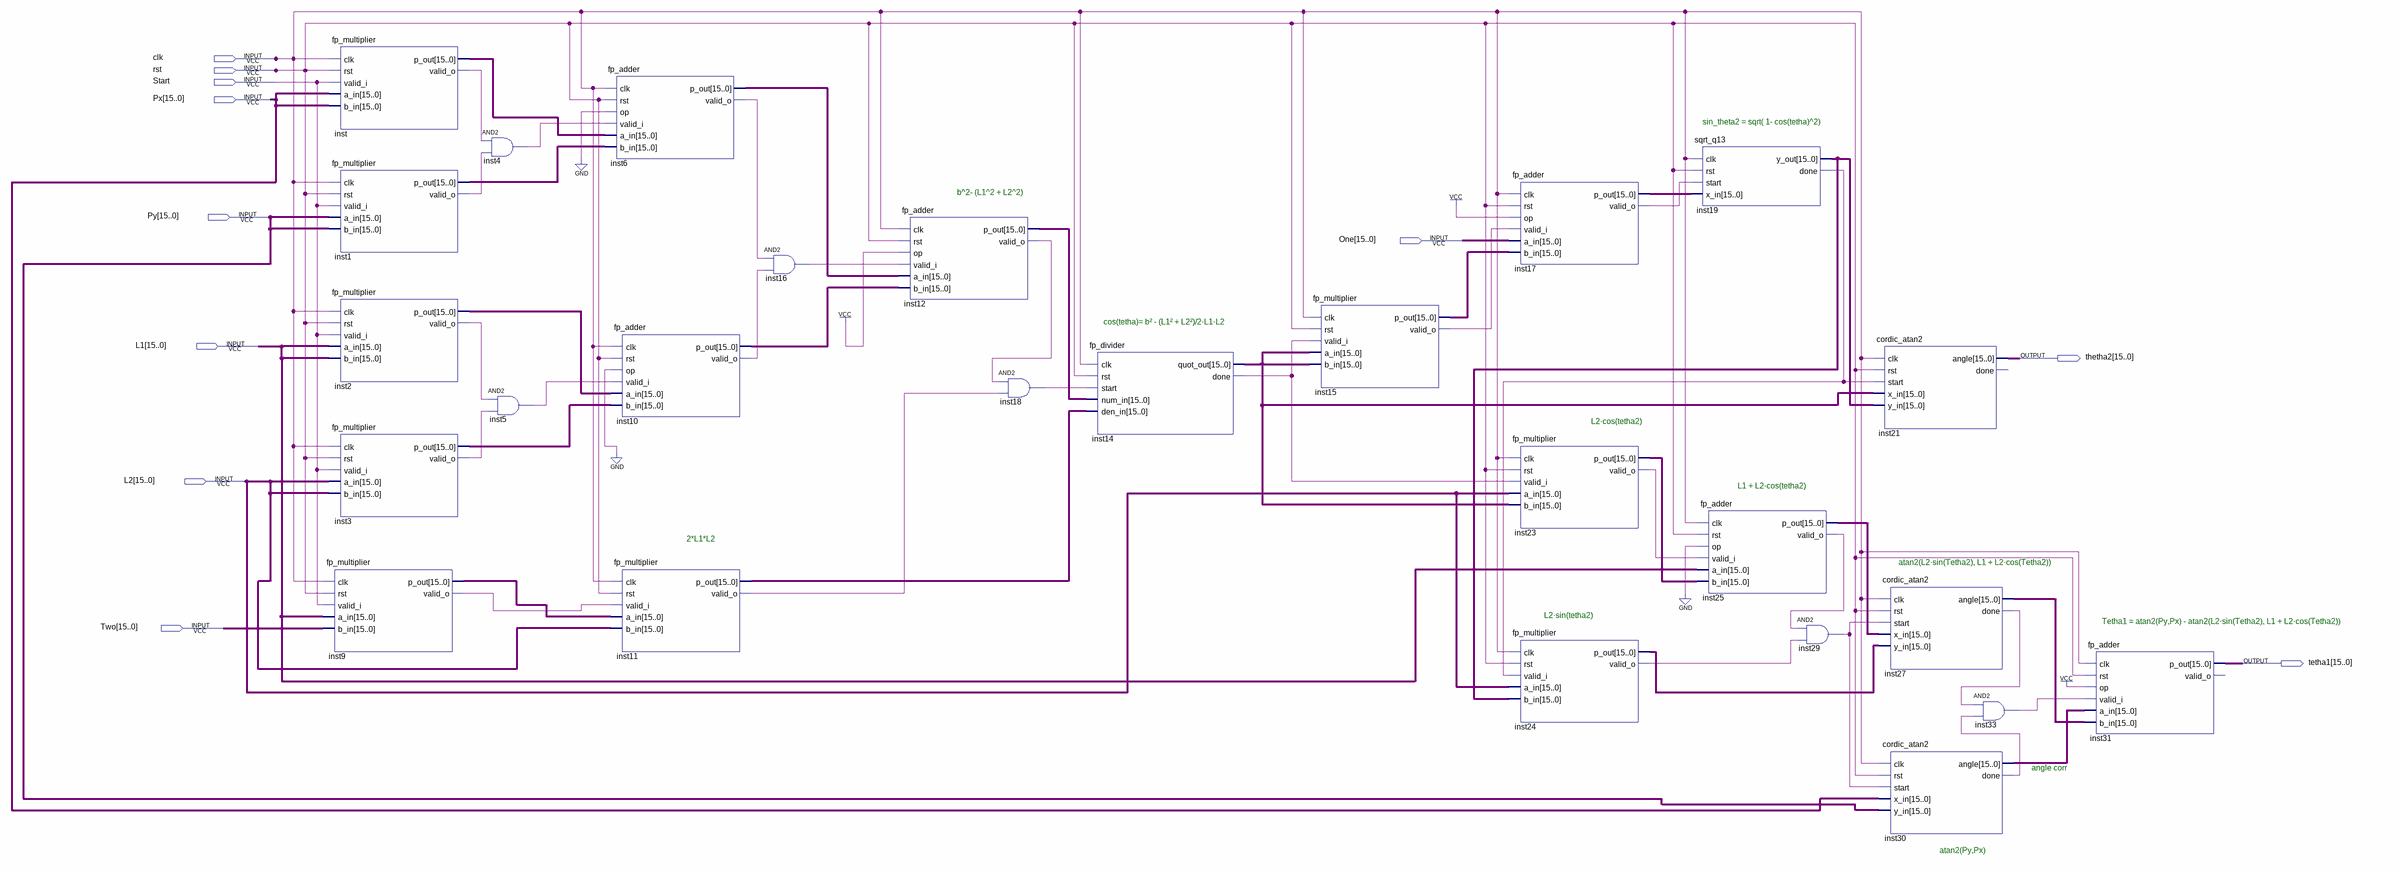
[diagram p0: schematic sheet]
// Quartus schematic Block2RTest.bdf as structural Verilog: 26 symbols, 11 pins
module Block2RTest (
  input  clk,
  input  rst,
  input  Start,
  input  [15:0] Px,
  input  [15:0] Py,
  input  [15:0] One,
  input  [15:0] L1,
  input  [15:0] L2,
  input  [15:0] Two,
  output [15:0] thetha2,
  output [15:0] tetha1
);

  wire inst1_valid_o, inst2_valid_o, inst3_valid_o, inst4_out, inst5_out, inst6_valid_o, inst9_valid_o,
       inst10_valid_o, inst11_valid_o, inst12_valid_o, inst14_done, inst15_valid_o, inst16_out,
       inst17_valid_o, inst18_out, inst19_done, inst23_valid_o, inst24_valid_o, inst25_valid_o, inst27_done,
       inst29_out, inst30_done, inst33_out, inst_valid_o;
  wire [15:0] inst1_p_out, inst2_p_out, inst3_p_out, inst6_p_out, inst9_p_out, inst10_p_out, inst11_p_out,
       inst12_p_out, inst14_quot_out, inst15_p_out, inst17_p_out, inst19_y_out, inst23_p_out, inst24_p_out,
       inst25_p_out, inst27_angle, inst30_angle, inst_p_out;

  fp_multiplier inst (
    .clk(clk), .rst(rst), .valid_i(Start), .a_in(Px), .b_in(Px), .p_out(inst_p_out), .valid_o(inst_valid_o));
  fp_multiplier inst1 (
    .clk(clk), .rst(rst), .valid_i(Start), .a_in(Py), .b_in(Py), .p_out(inst1_p_out), .valid_o(inst1_valid_o));
  fp_multiplier inst2 (
    .clk(clk), .rst(rst), .valid_i(Start), .a_in(L1), .b_in(L1), .p_out(inst2_p_out), .valid_o(inst2_valid_o));
  fp_multiplier inst3 (
    .clk(clk), .rst(rst), .valid_i(Start), .a_in(L2), .b_in(L2), .p_out(inst3_p_out), .valid_o(inst3_valid_o));
  fp_multiplier inst9 (
    .clk(clk), .rst(rst), .valid_i(Start), .a_in(L1), .b_in(Two), .p_out(inst9_p_out), .valid_o(inst9_valid_o));
  and inst4 (inst4_out, inst_valid_o, inst1_valid_o);
  and inst5 (inst5_out, inst2_valid_o, inst3_valid_o);
  fp_adder inst6 (
    .clk(clk), .rst(rst), .op(1'b0), .valid_i(inst4_out), .a_in(inst_p_out), .b_in(inst1_p_out),
    .p_out(inst6_p_out), .valid_o(inst6_valid_o));
  fp_adder inst10 (
    .clk(clk), .rst(rst), .op(1'b0), .valid_i(inst5_out), .a_in(inst2_p_out), .b_in(inst3_p_out),
    .p_out(inst10_p_out), .valid_o(inst10_valid_o));
  fp_multiplier inst11 (
    .clk(clk), .rst(rst), .valid_i(inst9_valid_o), .a_in(inst9_p_out), .b_in(L2), .p_out(inst11_p_out),
    .valid_o(inst11_valid_o));
  and inst16 (inst16_out, inst6_valid_o, inst10_valid_o);
  fp_adder inst12 (
    .clk(clk), .rst(rst), .op(1'b1), .valid_i(inst16_out), .a_in(inst6_p_out), .b_in(inst10_p_out),
    .p_out(inst12_p_out), .valid_o(inst12_valid_o));
  and inst18 (inst18_out, inst12_valid_o, inst11_valid_o);
  fp_divider inst14 (
    .clk(clk), .rst(rst), .start(inst18_out), .num_in(inst12_p_out), .den_in(inst11_p_out),
    .quot_out(inst14_quot_out), .done(inst14_done));
  fp_multiplier inst15 (
    .clk(clk), .rst(rst), .valid_i(inst14_done), .a_in(inst14_quot_out), .b_in(inst14_quot_out),
    .p_out(inst15_p_out), .valid_o(inst15_valid_o));
  fp_adder inst17 (
    .clk(clk), .rst(rst), .op(1'b1), .valid_i(inst15_valid_o), .a_in(One), .b_in(inst15_p_out),
    .p_out(inst17_p_out), .valid_o(inst17_valid_o));
  fp_multiplier inst23 (
    .clk(clk), .rst(rst), .valid_i(inst14_done), .a_in(L2), .b_in(inst14_quot_out), .p_out(inst23_p_out),
    .valid_o(inst23_valid_o));
  fp_multiplier inst24 (
    .clk(clk), .rst(rst), .valid_i(inst19_done), .a_in(L2), .b_in(inst19_y_out), .p_out(inst24_p_out),
    .valid_o(inst24_valid_o));
  sqrt_q13 inst19 (
    .clk(clk), .rst(rst), .start(inst17_valid_o), .x_in(inst17_p_out), .y_out(inst19_y_out),
    .done(inst19_done));
  fp_adder inst25 (
    .clk(clk), .rst(rst), .op(1'b0), .valid_i(inst23_valid_o), .a_in(L1), .b_in(inst23_p_out),
    .p_out(inst25_p_out), .valid_o(inst25_valid_o));
  and inst29 (inst29_out, inst25_valid_o, inst24_valid_o);
  cordic_atan2 inst21 (
    .clk(clk), .rst(rst), .start(inst19_done), .x_in(inst14_quot_out), .y_in(inst19_y_out), .angle(thetha2));  // open: done
  cordic_atan2 inst27 (
    .clk(clk), .rst(rst), .start(inst29_out), .x_in(inst25_p_out), .y_in(inst24_p_out), .angle(inst27_angle),
    .done(inst27_done));
  cordic_atan2 inst30 (
    .clk(clk), .rst(rst), .start(inst29_out), .x_in(Px), .y_in(Py), .angle(inst30_angle), .done(inst30_done));
  and inst33 (inst33_out, inst27_done, inst30_done);
  fp_adder inst31 (
    .clk(clk), .rst(rst), .op(1'b1), .valid_i(inst33_out), .a_in(inst30_angle), .b_in(inst27_angle),
    .p_out(tetha1));  // open: valid_o

  // Notes on the sheet:
  //   sin_theta2 = sqrt( 1- cos(tetha)^2)
  //   b^2- (L1^2 + L2^2)
  //   cos(tetha)= b² - (L1² + L2²)/2·L1·L2
  //   L2·cos(tetha2)
  //   L1 + L2·cos(tetha2)
  //   2*L1*L2
  //    atan2(L2·sin(Tetha2), L1 + L2·cos(Tetha2))
  //   L2·sin(tetha2)
  //   Tetha1 = atan2(Py,Px) - atan2(L2·sin(Tetha2), L1 + L2·cos(Tetha2))
  //   angle corr
  //    atan2(Py,Px)
endmodule
